# EAGLE design MC_amp (EAGLE 6.5.0)
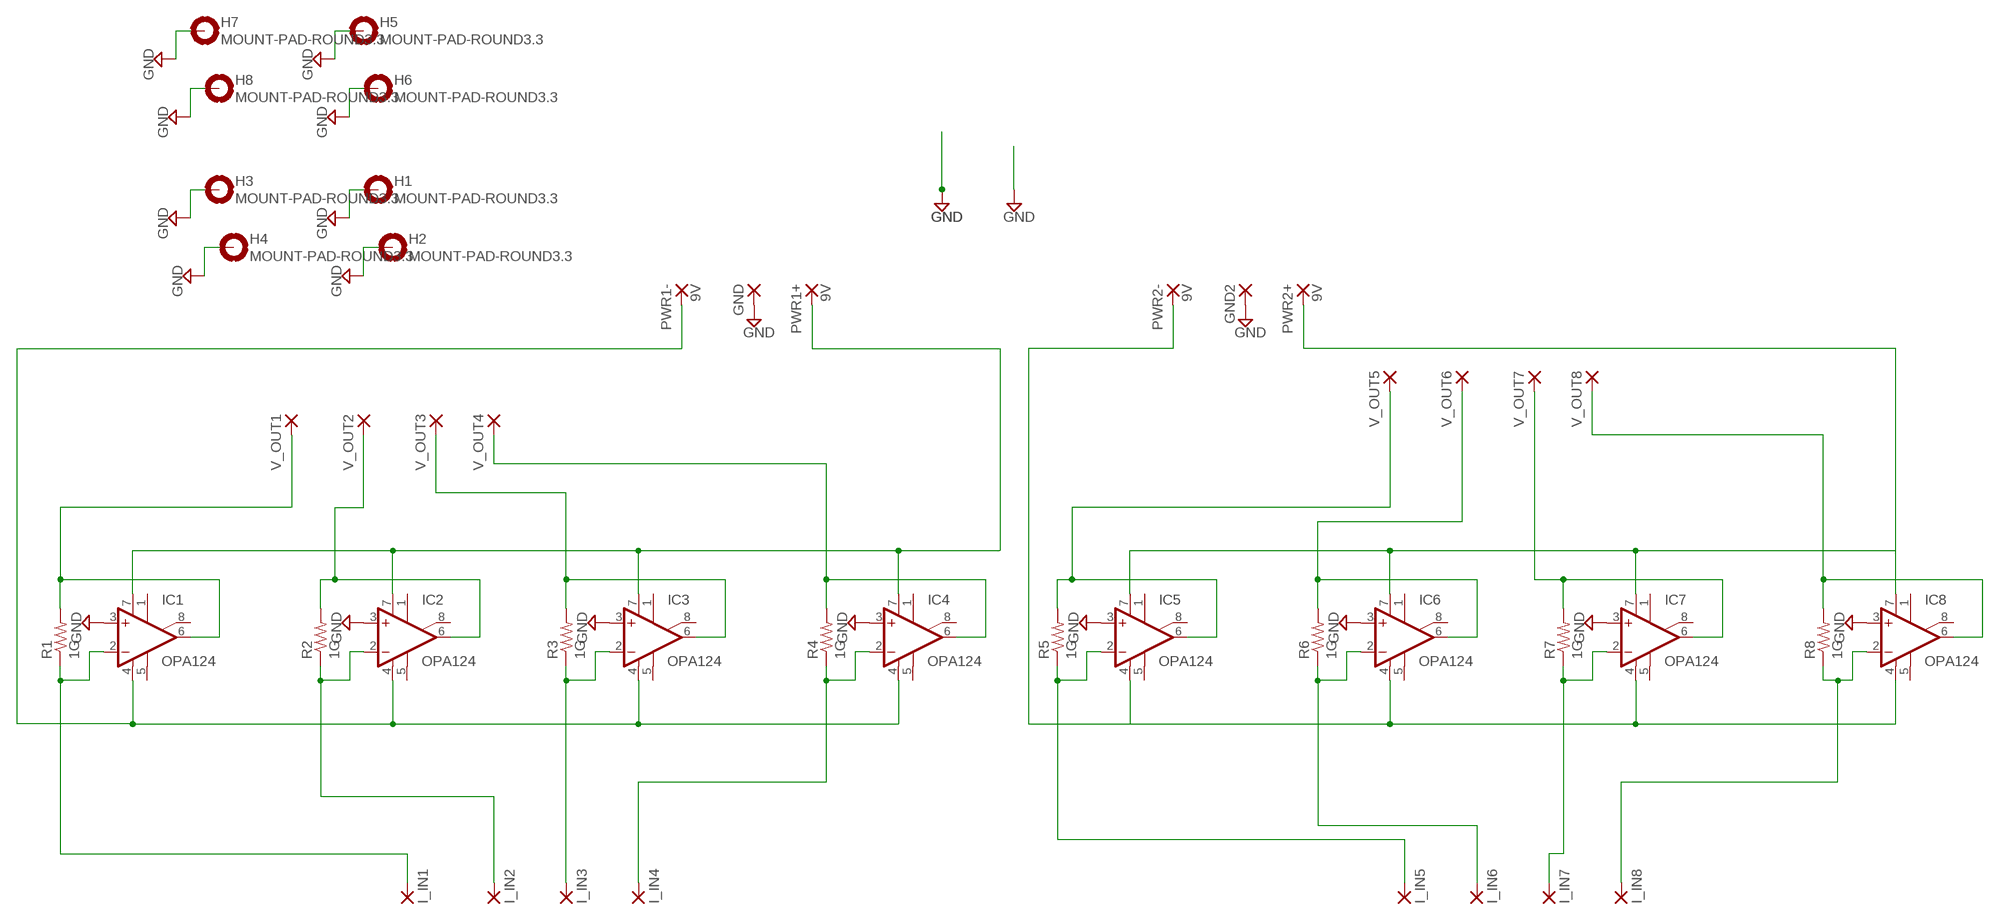
[diagram p0: schematic, sheet 1]

## Parts
GND  1,6/0,8  [1,6/0,8]
GND2  1,6/0,8  [1,6/0,8]
H1  MOUNT-PAD-ROUND3.3  [3,3-PAD]
H2  MOUNT-PAD-ROUND3.3  [3,3-PAD]
H3  MOUNT-PAD-ROUND3.3  [3,3-PAD]
H4  MOUNT-PAD-ROUND3.3  [3,3-PAD]
H5  MOUNT-PAD-ROUND3.3  [3,3-PAD]
H6  MOUNT-PAD-ROUND3.3  [3,3-PAD]
H7  MOUNT-PAD-ROUND3.3  [3,3-PAD]
H8  MOUNT-PAD-ROUND3.3  [3,3-PAD]
I_IN1  1,6/0,8  [1,6/0,8]
I_IN2  1,6/0,8  [1,6/0,8]
I_IN3  1,6/0,8  [1,6/0,8]
I_IN4  1,6/0,8  [1,6/0,8]
I_IN5  1,6/0,8  [1,6/0,8]
I_IN6  1,6/0,8  [1,6/0,8]
I_IN7  1,6/0,8  [1,6/0,8]
I_IN8  1,6/0,8  [1,6/0,8]
IC1  OPA124  OPA121P  [DIL08]
IC2  OPA124  OPA121P  [DIL08]
IC3  OPA124  OPA121P  [DIL08]
IC4  OPA124  OPA121P  [DIL08]
IC5  OPA124  OPA121P  [DIL08]
IC6  OPA124  OPA121P  [DIL08]
IC7  OPA124  OPA121P  [DIL08]
IC8  OPA124  OPA121P  [DIL08]
PWR1+  9V  1,6/0,8  [1,6/0,8]
PWR1-  9V  1,6/0,8  [1,6/0,8]
PWR2+  9V  1,6/0,8  [1,6/0,8]
PWR2-  9V  1,6/0,8  [1,6/0,8]
R1  1G  R-US_0309/12  [0309/12]
R2  1G  R-US_0309/12  [0309/12]
R3  1G  R-US_0309/12  [0309/12]
R4  1G  R-US_0309/12  [0309/12]
R5  1G  R-US_0309/12  [0309/12]
R6  1G  R-US_0309/12  [0309/12]
R7  1G  R-US_0309/12  [0309/12]
R8  1G  R-US_0309/12  [0309/12]
V_OUT1  1,6/0,8  [1,6/0,8]
V_OUT2  1,6/0,8  [1,6/0,8]
V_OUT3  1,6/0,8  [1,6/0,8]
V_OUT4  1,6/0,8  [1,6/0,8]
V_OUT5  1,6/0,8  [1,6/0,8]
V_OUT6  1,6/0,8  [1,6/0,8]
V_OUT7  1,6/0,8  [1,6/0,8]
V_OUT8  1,6/0,8  [1,6/0,8]

## Nets
GND: GND2.1(P) GND.1(P) H1.B3,3(MOUNT) H2.B3,3(MOUNT) H3.B3,3(MOUNT) H4.B3,3(MOUNT) H5.B3,3(MOUNT) H6.B3,3(MOUNT) H7.B3,3(MOUNT) H8.B3,3(MOUNT) IC1.3(+IN) IC2.3(+IN) IC3.3(+IN) IC4.3(+IN) IC5.3(+IN) IC6.3(+IN) IC7.3(+IN) IC8.3(+IN)
N$1: I_IN1.1(P) IC1.2(-IN) R1.1
N$2: IC1.6(OUT) R1.2 V_OUT1.1(P)
N$3: IC1.7(V+) IC2.7(V+) IC3.7(V+) IC4.7(V+) PWR1+.1(P)
N$5: IC2.6(OUT) R2.2 V_OUT2.1(P)
N$6: I_IN2.1(P) IC2.2(-IN) R2.1
N$7: I_IN3.1(P) IC3.2(-IN) R3.1
N$8: IC3.6(OUT) R3.2 V_OUT3.1(P)
N$9: IC5.4(V-) IC6.4(V-) IC7.4(V-) IC8.4(V-) PWR2-.1(P)
N$10: I_IN4.1(P) IC4.2(-IN) R4.1
N$11: IC4.6(OUT) R4.2 V_OUT4.1(P)
N$13: I_IN5.1(P) IC5.2(-IN) R5.1
N$14: IC5.6(OUT) R5.2 V_OUT5.1(P)
N$15: IC5.7(V+) IC6.7(V+) IC7.7(V+) IC8.7(V+) PWR2+.1(P)
N$16: I_IN6.1(P) IC6.2(-IN) R6.1
N$17: IC6.6(OUT) R6.2 V_OUT6.1(P)
N$19: I_IN7.1(P) IC7.2(-IN) R7.1
N$20: IC7.6(OUT) R7.2 V_OUT7.1(P)
N$22: I_IN8.1(P) IC8.2(-IN) R8.1
N$23: IC8.6(OUT) R8.2 V_OUT8.1(P)
N$25: IC1.4(V-) IC2.4(V-) IC3.4(V-) IC4.4(V-) PWR1-.1(P)
Unconnected: IC1.1(ON1) IC1.5(OPT) IC1.8(ON2) IC2.1(ON1) IC2.5(OPT) IC2.8(ON2) IC3.1(ON1) IC3.5(OPT) IC3.8(ON2) IC4.1(ON1) IC4.5(OPT) IC4.8(ON2) IC5.1(ON1) IC5.5(OPT) IC5.8(ON2) IC6.1(ON1) IC6.5(OPT) IC6.8(ON2) IC7.1(ON1) IC7.5(OPT) IC7.8(ON2) IC8.1(ON1) IC8.5(OPT) IC8.8(ON2)

## Library data of the parts
GND GND2 I_IN1-I_IN8 PWR1+ PWR1- PWR2+ PWR2- V_OUT1-V_OUT8 = wirepad:1,6/0,8: THROUGH-HOLE PAD
H1-H8 = holes:MOUNT-PAD-ROUND: MOUNTING PAD, round
IC1-IC8 = linear:OPA121: OP AMP
R1-R8 = resistor:R-US_: RESISTOR, American symbol

## Board
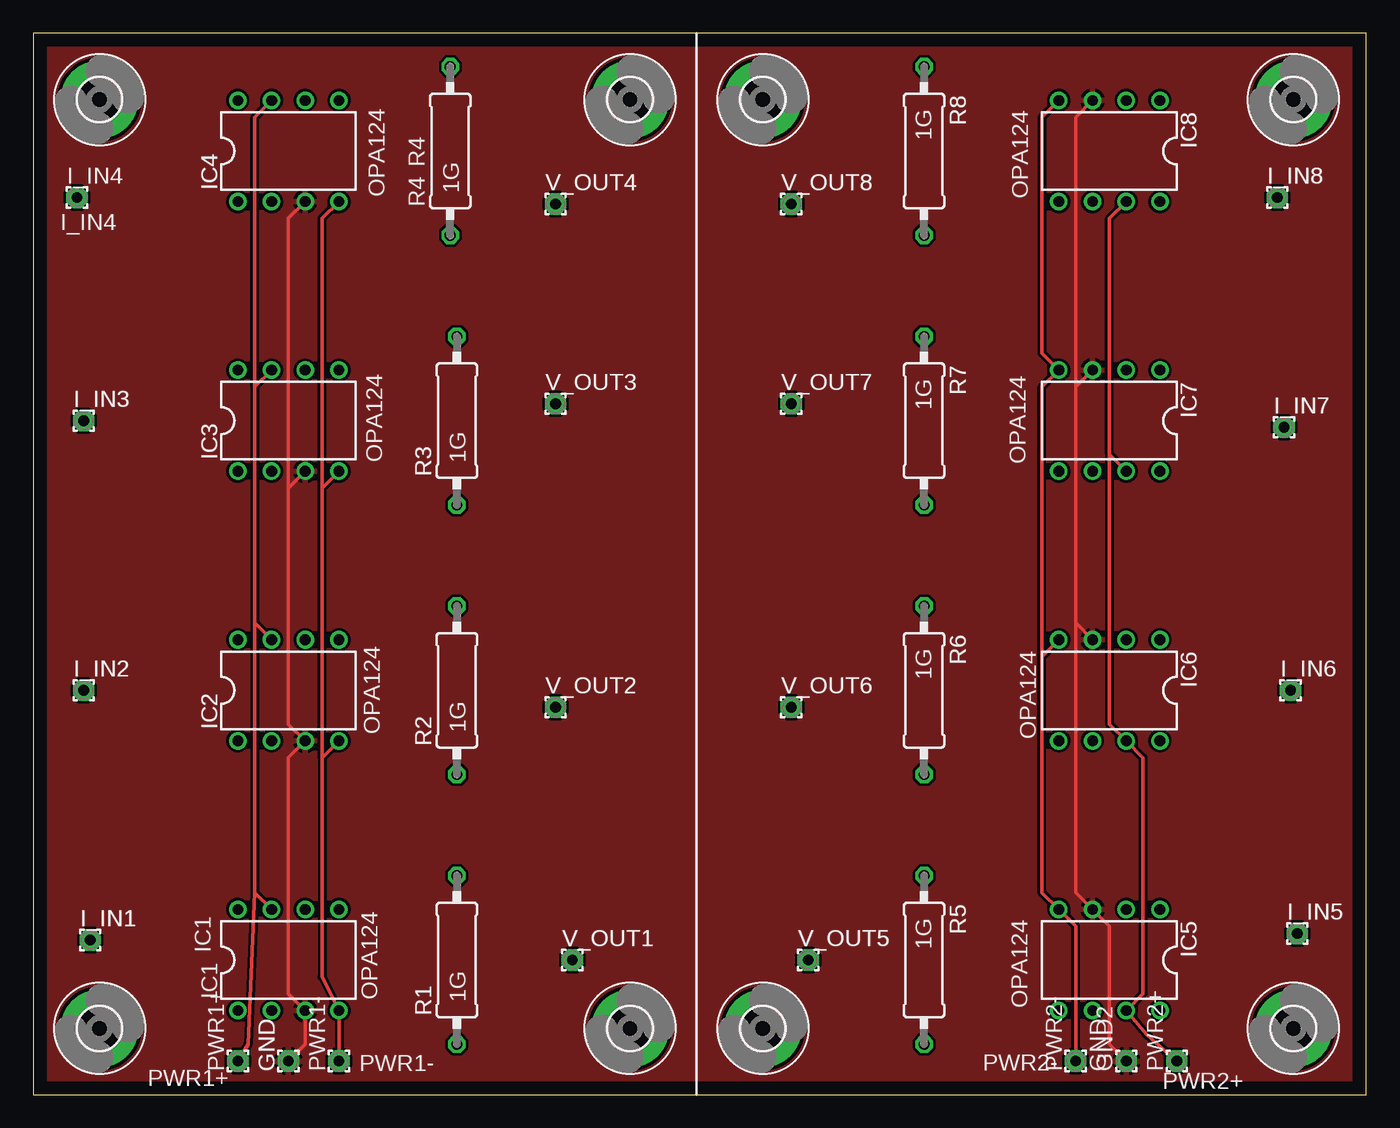
[diagram p1: board, top side]
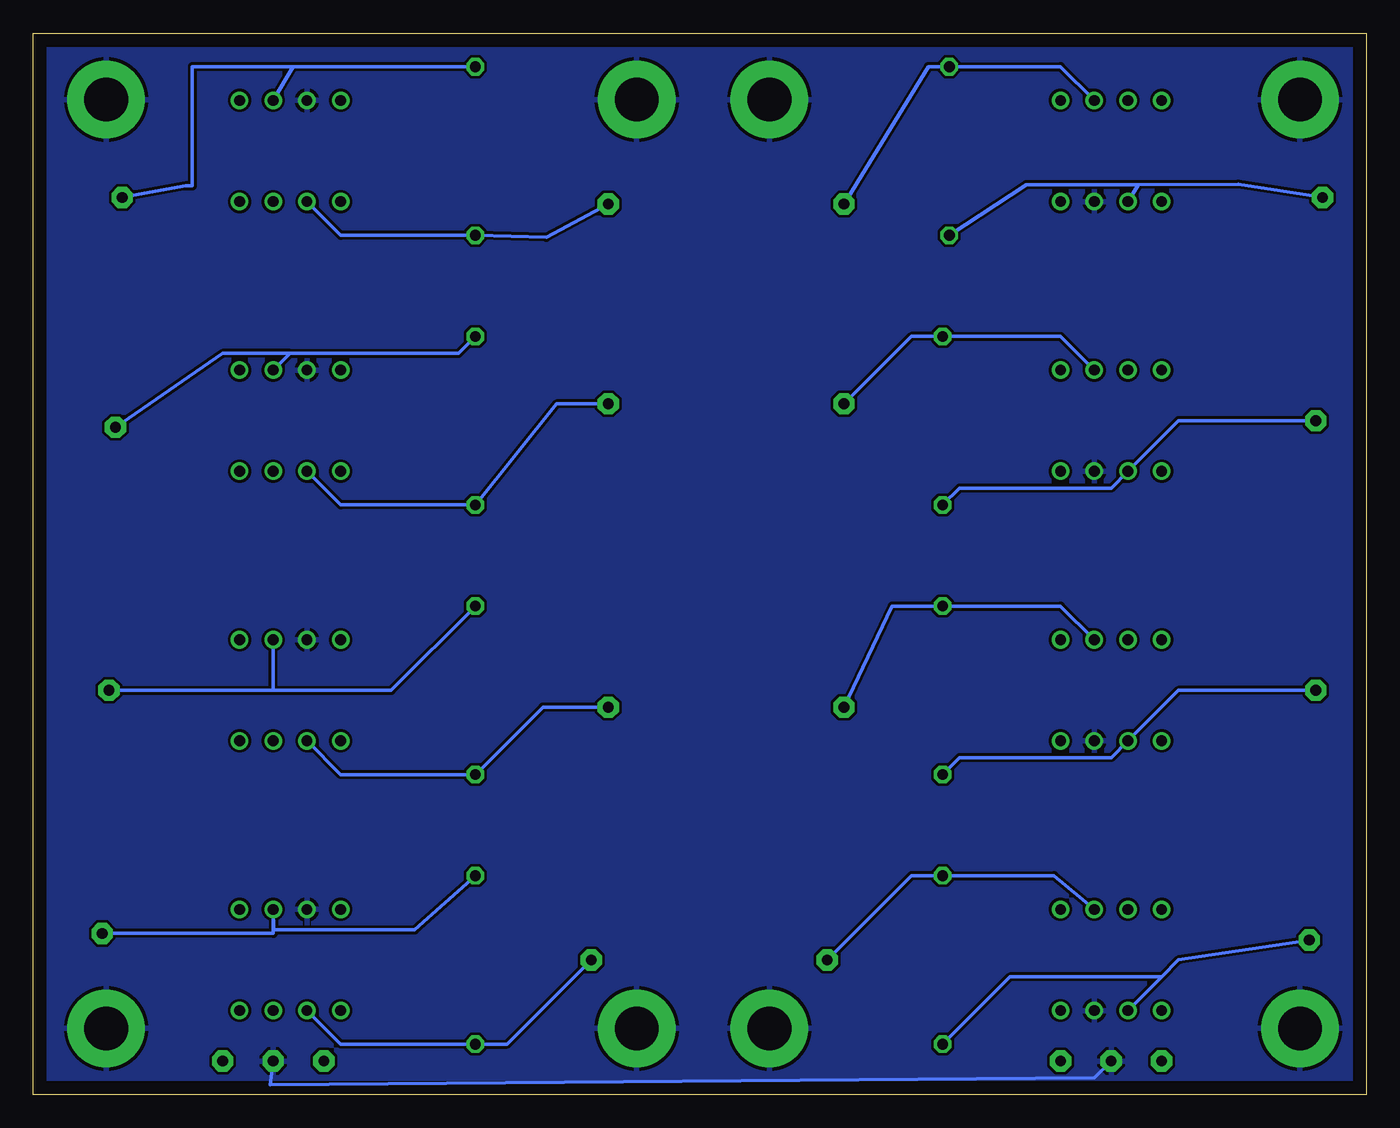
[diagram p2: board, bottom side, seen from below]

Size 100.5 x 80 mm. Coordinates in mm from the lower left corner, seen from the top.
Outline: 0,0 100.5,0 100.5,80 0,80 0,0
Copper layers (1*16): Top 0.035mm / dielectric 1.5mm / Bottom 0.035mm
Design rules "default": minimum track width 10mil, minimum drill 24mil, track to track 8mil, track to pad 8mil, pad to pad 8mil, via to via 8mil, smd to smd 8mil, copper to edge 40mil, drill to drill 8mil, minimum pad ring 10mil, minimum via ring 8mil, stop-mask expansion 4mil, vias tented up to drill 0mil, thermal gap 10mil

### Footprints (pad centres in the part's own frame; a part is rotated, then mirrored left to right if it is on the bottom)
1,6/0,8 = drill 0.813 pad 1.6 octagon: 1 0,0
3,3-PAD = drill 3.3 pad 5.842: B3,3 0,0
DIL08 = drill 0.813 pad 1.27: 1 -3.81,-3.81; 2 -1.27,-3.81; 3 1.27,-3.81; 4 3.81,-3.81; 5 3.81,3.81; 6 1.27,3.81; 7 -1.27,3.81; 8 -3.81,3.81
0309/12 = drill 0.813 octagon: 1 -6.35,0; 2 6.35,0

### Placement (x,y rotation side)
GND  19.24,2.54 90 top
GND2  82.4,2.54 90 top
H1  5,5 0 top
H2  45,5 0 top
H3  55,5 0 top
H4  95,5 0 top
H5  95,75 0 top
H6  55,75 0 top
H7  45,75 0 top
H8  5,75 0 top
I_IN1  4.31,11.66 0 top
I_IN2  3.81,30.48 0 top
I_IN3  3.81,50.8 0 top
I_IN4  3.31,67.62 0 top
I_IN5  95.29,12.16 0 top
I_IN6  94.79,30.48 0 top
I_IN7  94.29,50.3 0 top
I_IN8  93.79,67.62 0 top
IC1  19.24,10.16 0 top
IC2  19.24,30.48 0 top
IC3  19.24,50.8 0 top
IC4  19.24,71.12 0 top
IC5  81.13,10.16 180 top
IC6  81.13,30.48 180 top
IC7  81.13,50.8 180 top
IC8  81.13,71.12 180 top
PWR1+  15.43,2.54 90 top
PWR1-  23.05,2.54 90 top
PWR2+  86.21,2.54 90 top
PWR2-  78.59,2.54 90 top
R1  31.94,10.16 90 top
R2  31.94,30.48 90 top
R3  31.94,50.8 90 top
R4  31.44,71.12 90 top
R5  67.16,10.16 270 top
R6  67.16,30.48 270 top
R7  67.16,50.8 270 top
R8  67.16,71.12 270 top
V_OUT1  40.64,10.16 0 top
V_OUT2  39.37,29.21 0 top
V_OUT3  39.37,52.07 0 top
V_OUT4  39.37,67.12 0 top
V_OUT5  58.42,10.16 0 top
V_OUT6  57.15,29.21 0 top
V_OUT7  57.15,52.07 0 top
V_OUT8  57.15,67.12 0 top

### Tracks (layer width: path | path; a pad name or v marks a point on that pad's centre or on a via)
GND
  Top 0.254: 19.24,45.72 19.24,27.94 IC2.3 19.24,25.4 19.24,7.62 IC1.3 20.51,3.81 GND.1 | IC3.3 19.24,45.72 | IC4.3 19.24,66.04 19.24,45.72 | GND2.1 81.13,3.81 81.13,12.7 IC5.3 78.59,15.24 78.59,35.56 | 78.59,35.56 IC6.3 | 78.59,53.34 78.59,35.56 | IC7.3 78.59,53.34 | IC8.3 78.59,73.66 78.59,53.34
  Bottom 0.254: GND.1 20.51,1.27 82.63,0.77 GND2.1
  pour Top: 0,80.01 100.33,80.01 100.33,0 0,0
  pour Bottom: 0,80.01 100.33,80.01 100.33,0 0,0
N$1
  Bottom 0.254: 15.43,8.89 14.16,10.16 I_IN1.1 | 15.43,8.89 IC1.2 | R1.1 26.86,8.89 15.43,8.89
N$2
  Bottom 0.254: IC1.6 23.55,16.51 R1.2 34.29,16.51 V_OUT1.1
N$3
  Top 0.254: 16.7,53.34 IC3.7 | IC4.7 16.7,73.66 16.7,53.34 | 16.7,35.56 IC2.7 | 16.7,53.34 16.7,35.56 | 16.7,15.24 IC1.7 | 16.7,35.56 16.7,15.24 | PWR1+.1 16.2,3.81 16.7,15.24
N$5
  Bottom 0.254: IC2.6 23.05,36.83 R2.2 35.75,36.83 V_OUT2.1
N$6
  Bottom 0.254: I_IN2.1 14.16,30.48 IC2.2 19.24,25.4 30.67,25.4 R2.1
N$7
  Bottom 0.254: I_IN3.1 14.16,50.8 IC3.2 19.24,45.72 30.67,45.72 R3.1
N$8
  Bottom 0.254: IC3.6 23.05,57.15 R3.2 34.29,57.15 V_OUT3.1
N$9
  Top 0.254: IC6.4 76.05,33.02 | IC8.4 76.05,73.66 76.05,55.88 IC7.4 76.05,53.34 76.05,33.02 | PWR2-.1 78.59,12.7 IC5.4 76.05,15.24 76.05,33.02
N$10
  Bottom 0.254: 17.2,68.58 9.66,68.62 I_IN4.1 | 17.2,68.58 IC4.2 | R4.1 25.63,68.58 17.2,68.58
N$11
  Bottom 0.254: IC4.6 23.05,77.47 R4.2 33.02,77.47 V_OUT4.1
N$13
  Bottom 0.254: R5.1 71.74,12.43 82.36,12.43 IC5.2 82.4,12.16 I_IN5.1
N$14
  Bottom 0.254: V_OUT5.1 64.77,3.81 R5.2 77.32,3.81 IC5.6
N$15
  Top 0.254: IC8.7 81.13,66.04 81.13,48.26 | IC7.7 81.13,48.26 | PWR2+.1 83.94,4.54 IC5.7 83.67,7.62 83.67,25.4 IC6.7 81.13,27.94 81.13,48.26
N$16
  Bottom 0.254: R6.1 73.51,30.48 82.4,30.48 | I_IN6.1 82.4,30.48 | 82.4,30.48 IC6.2
N$17
  Bottom 0.254: V_OUT6.1 62.08,29.21 R6.2 77.32,24.13 IC6.6
N$19
  Bottom 0.254: R7.1 68.43,55.88 81.13,55.88 | IC7.2 81.13,55.88 | I_IN7.1 86.21,55.88 81.13,55.88
N$20
  Bottom 0.254: V_OUT7.1 61.04,52.07 R7.2 77.32,44.45 IC7.6
N$22
  Bottom 0.254: R8.1 80.9,77.47 | IC8.2 80.9,77.47 | 80.9,77.47 88.5,77.47 88.5,68.5 89,68.5 I_IN8.1
N$23
  Bottom 0.254: V_OUT8.1 61.81,64.62 R8.2 77.32,64.77 IC8.6
N$25
  Top 0.254: 21.78,25.4 21.78,8.89 IC1.4 PWR1-.1 | IC2.4 21.78,25.4 | 21.78,45.72 IC3.4 | 21.78,25.4 21.78,45.72 | IC4.4 21.78,66.04 21.78,45.72

### Text on the board
_tsilk: R8 | 1G | OPA124 | IC8 | R4 | I_IN8 | IC4 | OPA124 | 1G | V_OUT4 | V_OUT8 | I_IN4 | R7 | 1G | OPA124 | IC7 | V_OUT3 | V_OUT7 | I_IN3 | I_IN7 | IC3 | OPA124 | 1G | R3 | R6 | 1G | IC6 | I_IN2 | I_IN6 | V_OUT2 | V_OUT6 | IC2 | OPA124 | 1G | OPA124 | R2 | R5 | I_IN1 | 1G | OPA124 | IC5 | I_IN5 | IC1 | V_OUT1 | V_OUT5 | OPA124 | 1G | R1 | 9V | 9V | PWR1- | PWR2- | 9V | 9V | PWR1+ | GND | GND | PWR2+